# EAGLE design First Board (EAGLE 9.6.2)
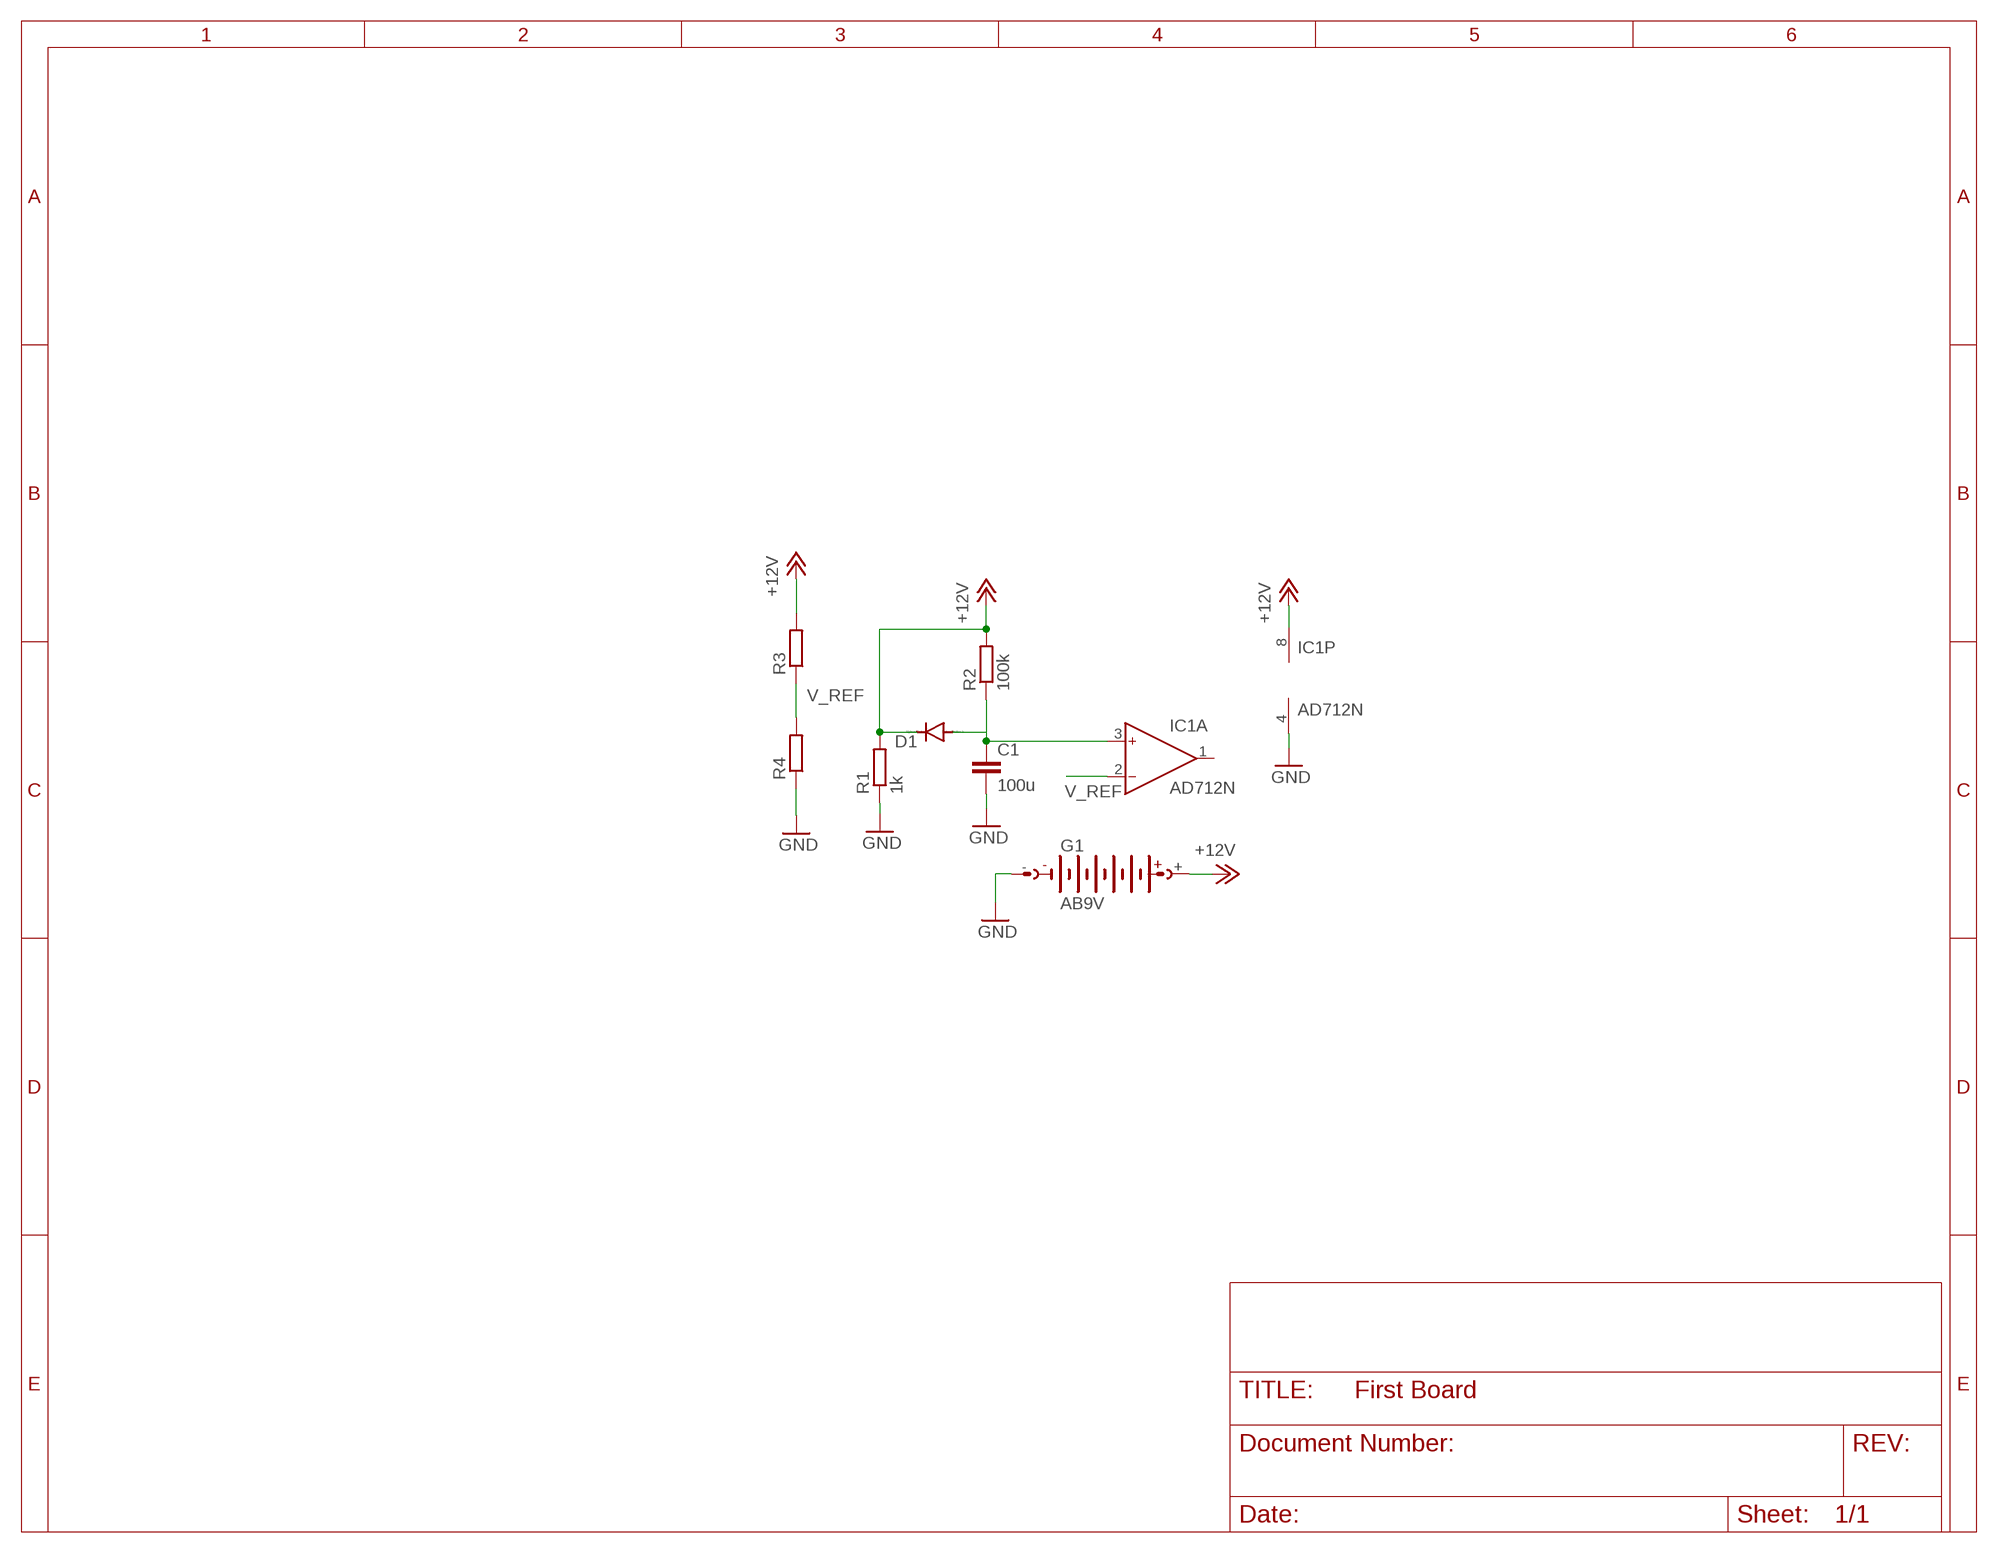
[diagram p0: schematic, sheet 1]

## Parts
C1  100u  C-EUC0805  [C0805]
D1  DIODE-DO214AC  [DO214AC]
G1  AB9V  [AB9V]
IC1  AD712N  [DIL08]
R1  1k  R-EU_M0805  [M0805]
R2  100k  R-EU_M0805  [M0805]
R3  R-EU_M0805  [M0805]
R4  R-EU_M0805  [M0805]

## Nets
+12V: D1.C G1.+ IC1.8(P:V+) R1.2 R2.2 R3.2
GND: C1.2 G1.- IC1.4(P:V-) R1.1 R4.1
N$1: C1.1 D1.A IC1.3(A:IN+) R2.1
V_REF: IC1.2(A:IN-) R3.1 R4.2
Unconnected: IC1.1(A:OUT) IC1.5(B:IN+) IC1.6(B:IN-) IC1.7(B:OUT)

## Library data of the parts
C1 = rcl:C-EU: CAPACITOR, European symbol; SPICEPREFIX: C
D1 = diode:DIODE-: DIODE
G1 = battery:AB9V: 9-V BATTERY CLIP
IC1 = analog-devices:AD712: Dual Precision, Low Cost, High Speed BiFET Op Amp Source: http://www.analog.com/static/imported-files/data_sheets/AD712.pdf; MF: ALTERA CORPORATION; MPN: AD712JNZ; OC_FARNELL: 9604898; OC_NEWARK: 59K4554
R1-R4 = rcl:R-EU_: RESISTOR, European symbol; SPICEPREFIX: R

## Board
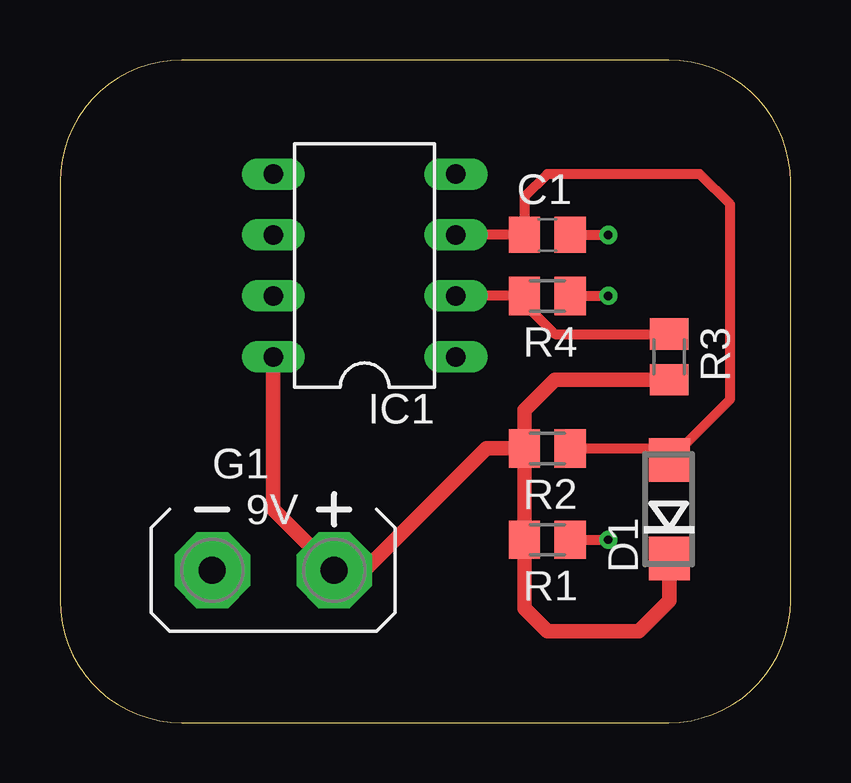
[diagram p1: board, top side]
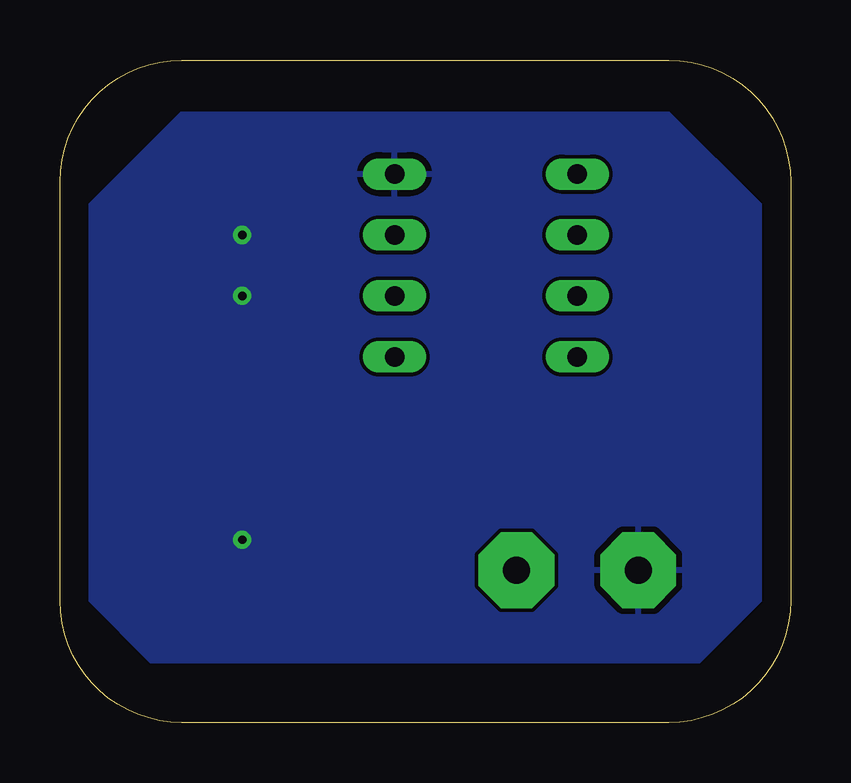
[diagram p2: board, bottom side, seen from below]

Size 30.46 x 27.61 mm. Coordinates in mm from the lower left corner, seen from the top.
Outline: 0,22.53 0,5.08 arc90 5.08,0 25.38,0 arc90 30.46,5.08 30.46,22.53 arc90 25.38,27.61 5.08,27.61 arc90 0,22.53
Copper layers (1*16): Top 0.035mm / dielectric 1.5mm / Bottom 0.035mm
Design rules "default": minimum track width 6mil, minimum drill 0.35mm, track to track 6mil, track to pad 6mil, pad to pad 6mil, via to via 6mil, smd to smd 6mil, copper to edge 40mil, drill to drill 6mil, minimum pad ring 10mil, minimum via ring 8mil, stop-mask expansion 4mil, vias tented up to drill 0mil, thermal gap 10mil

### Footprints (pad centres in the part's own frame; a part is rotated, then mirrored left to right if it is on the bottom)
C0805 = smd 1.3 x 1.5: 1 -0.95,0; 2 0.95,0
DO214AC = smd 1.8 x 1.7: A 2.05,0; C -2.05,0
AB9V = drill 1.118 pad 3.15 octagon: + 0,2.54; - 0,-2.54
DIL08 = drill 0.813 long: 1 -3.81,-3.81; 2 -1.27,-3.81; 3 1.27,-3.81; 4 3.81,-3.81; 5 3.81,3.81; 6 1.27,3.81; 7 -1.27,3.81; 8 -3.81,3.81
M0805 = smd 1.3 x 1.6: 1 -0.95,0; 2 0.95,0

### Placement (x,y rotation side)
C1  20.32,20.32 0 top
D1  25.4,8.89 90 top
G1  8.89,6.35 270 top
IC1  12.7,19.05 90 top
R1  20.32,7.62 180 top
R2  20.32,11.43 180 top
R3  25.4,15.24 270 top
R4  20.32,17.78 180 top

### Tracks (layer width: path | path; a pad name or v marks a point on that pad's centre or on a via)
+12V
  Top 0.61: R2.2 17.78,11.43 12.7,6.35 G1.+ 8.89,8.89 IC1.8 | R2.2 19.37,13.02 20.64,14.29 R3.2 | R2.2 R1.2 19.37,4.76 20.32,3.81 24.13,3.81 25.4,5.08 D1.C
GND  (via drill 0.35)
  Top 0.406: C1.2 v22.86,20.32 | R4.1 v22.86,17.78 | R1.1 v22.86,7.62
  pour Bottom: 5.08,25.4 25.4,25.4 29.21,21.59 29.21,5.08 26.67,2.54 3.81,2.54 1.27,5.08 1.27,21.59
N$1
  Top 0.406: R2.1 24.91,11.43 D1.A 27.94,13.48 27.94,21.59 26.67,22.86 20.32,22.86 19.37,21.91 C1.1 IC1.3
V_REF
  Top 0.406: R3.1 20.64,16.19 19.37,17.46 R4.2 IC1.2